# Altium schematic sheet ver060_ADC.SchDoc
size A3; SheetNumber: 4; SheetTotal: 6
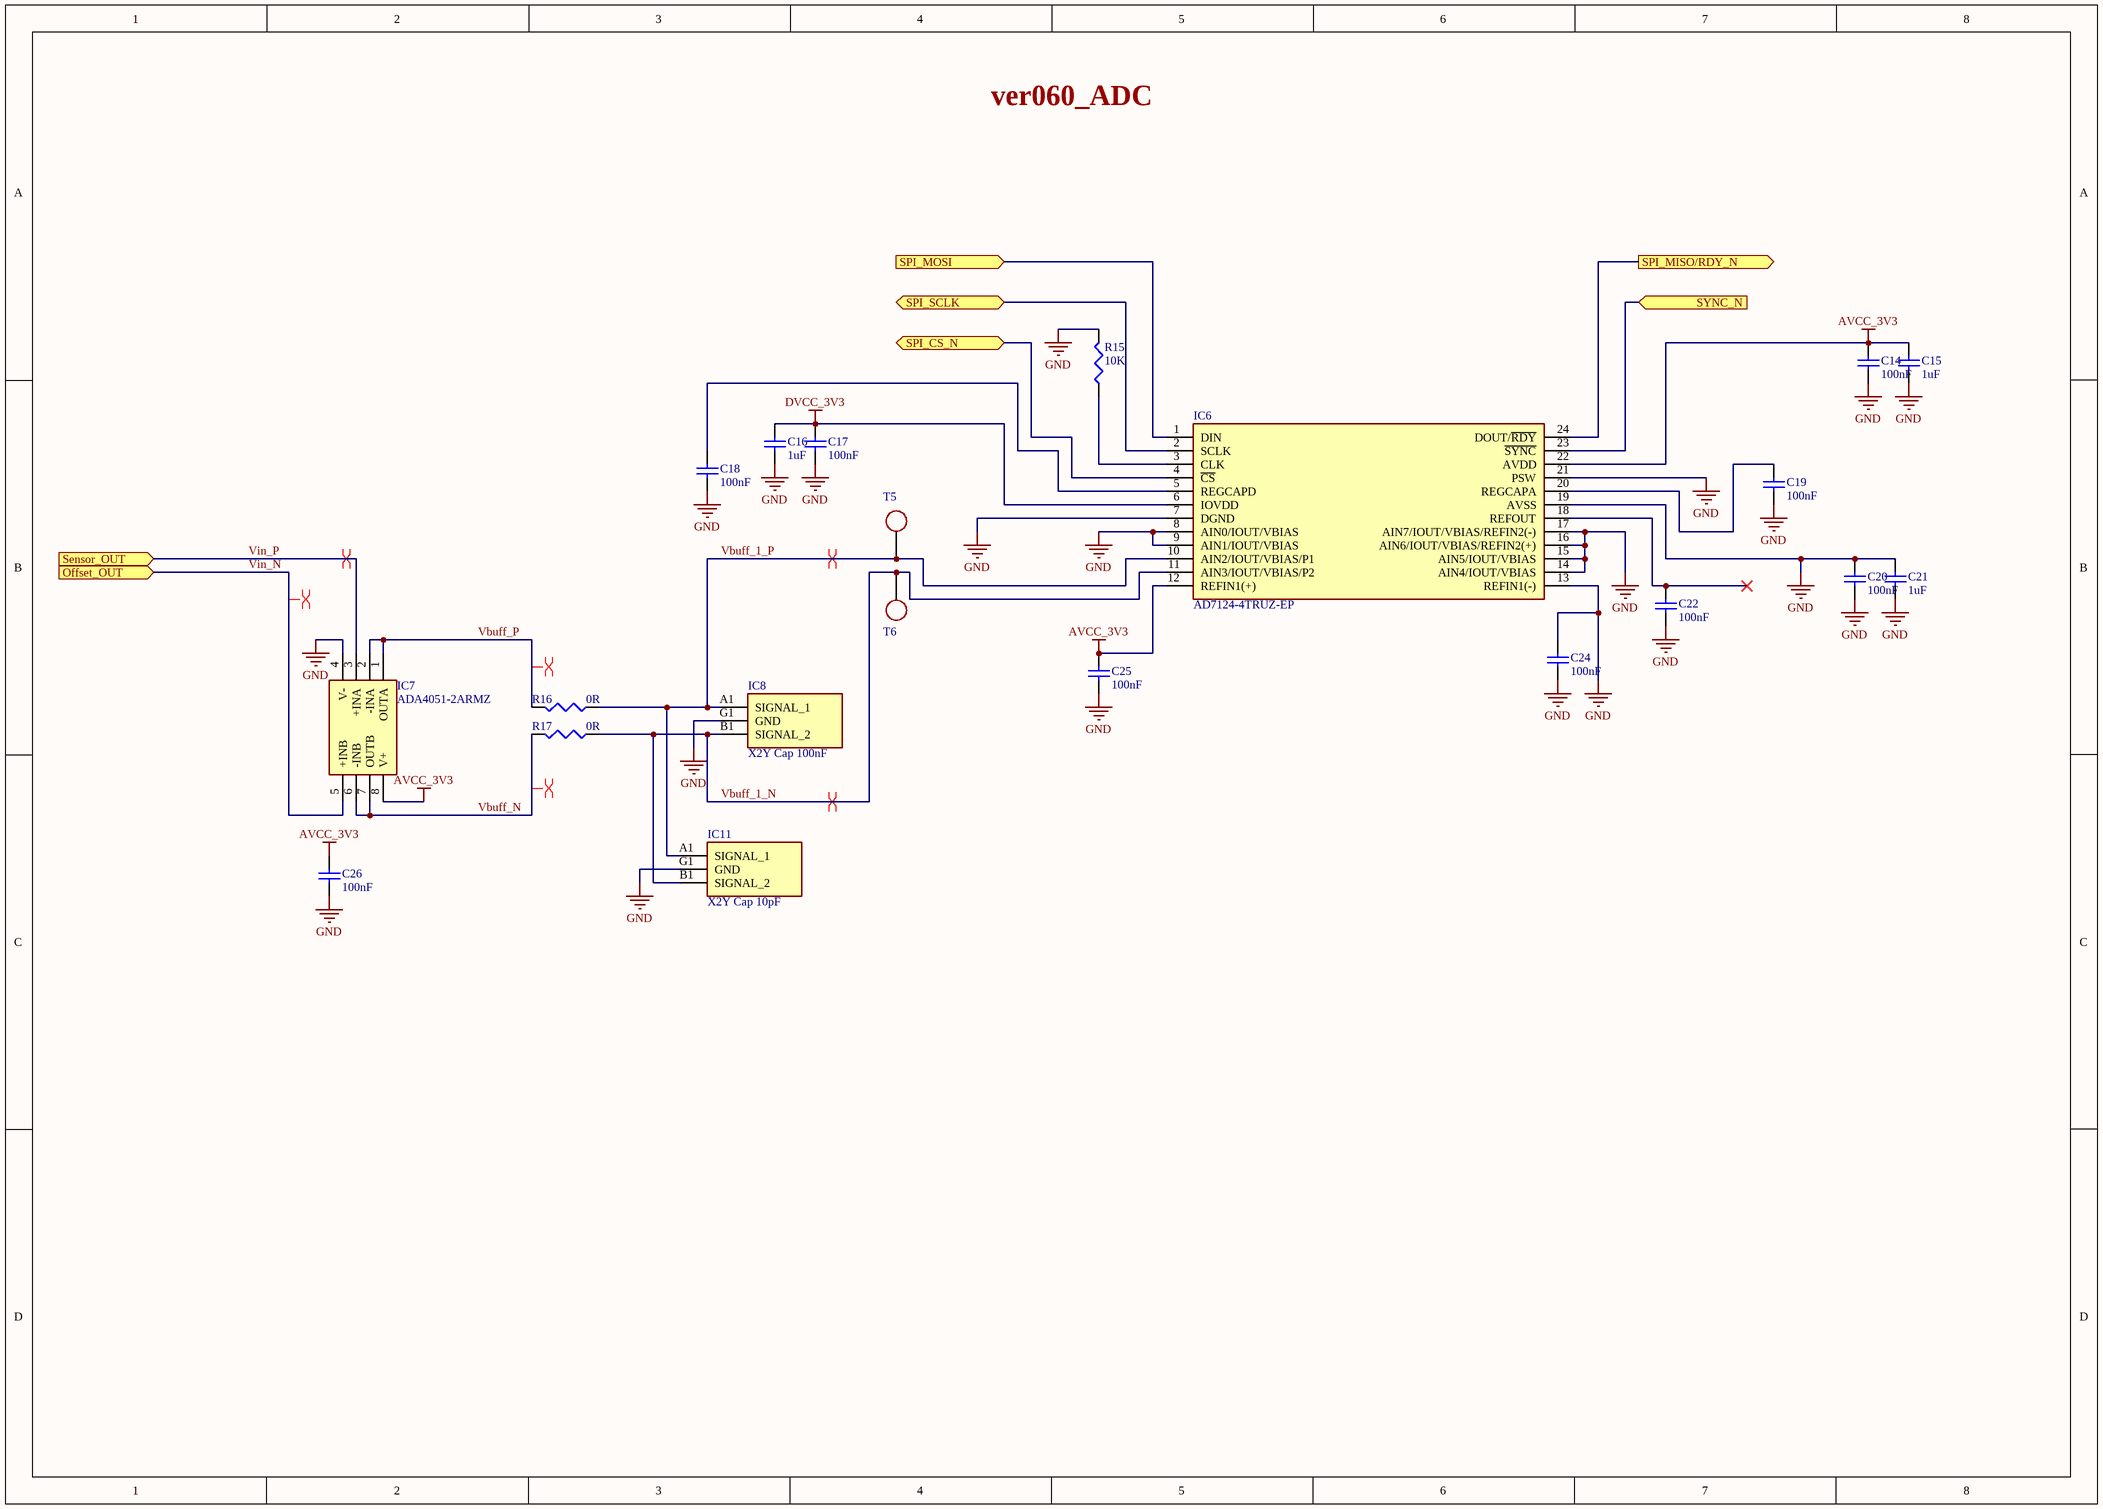
[diagram p0: ver060_ADC.SchDoc]

## Parts
C14  value 100nF  [1608[0603]]  (hidden comment: Cap Semi)
C15  value 1uF  [1608[0603]]  (hidden comment: Cap Semi)
C16  value 1uF  [1608[0603]]  (hidden comment: Cap Semi)
C17  value 100nF  [1608[0603]]  (hidden comment: Cap Semi)
C18  value 100nF  [1608[0603]]  (hidden comment: Cap Semi)
C19  value 100nF  [1608[0603]]  (hidden comment: Cap Semi)
C20  value 100nF  [1608[0603]]  (hidden comment: Cap Semi)
C21  value 1uF  [1608[0603]]  (hidden comment: Cap Semi)
C22  value 100nF  [1608[0603]]  (hidden comment: Cap Semi)
C24  value 100nF  [1608[0603]]  (hidden comment: Cap Semi)
C25  value 100nF  [1608[0603]]  (hidden comment: Cap Semi)
C26  value 100nF  [1608[0603]]  (hidden comment: Cap Semi)
IC6  AD7124-4TRUZ-EP  [SOP65P640X120-24N]
IC7  ADA4051-2ARMZ  [SOP65P490X110-8N]
IC8  X2Y Cap 100nF  [500X14W102MV4T]
IC11  X2Y Cap 10pF  [500X14W102MV4T]
R15  value 10K  [J1-0603]  (hidden comment: Res3)
R16  value 0R  [J1-0603]  (hidden comment: Res3)
R17  value 0R  [J1-0603]  (hidden comment: Res3)
T5  TP_SMT  [TP_SMT_Round_0.6x0.6]  (value not drawn)
T6  TP_SMT  [TP_SMT_Round_0.6x0.6]  (value not drawn)

## Ports
Offset_OUT (in), Sensor_OUT (in), SPI_CS_N (bidir), SPI_MISO/RDY_N (out), SPI_MOSI (in), SPI_SCLK (bidir), SYNC_N (in)

## Nets
AVCC_3V3: C14.1 C15.1 C25.1 C26.1 IC6.12(REFIN1(+)) IC6.22(AVDD) IC7.8(V+)
DVCC_3V3: C16.1 C17.1 IC6.6(IOVDD)
GND: C14.2 C15.2 C16.2 C17.2 C18.2 C19.2 C20.1 C20.2 C21.1 C21.2 C22.2 C24.1 C24.2 C25.2 C26.2 IC6.7(DGND) IC6.8(AIN0/IOUT/VBIAS) IC6.9(AIN1/IOUT/VBIAS) IC6.13(REFIN1(-)) IC6.14(AIN4/IOUT/VBIAS) IC6.15(AIN5/IOUT/VBIAS) IC6.16(AIN6/IOUT/VBIAS/REFIN2(+)) IC6.17(AIN7/IOUT/VBIAS/REFIN2(-)) IC6.19(AVSS) IC6.21(PSW) IC7.4(V-) IC8.G1(GND) IC11.G1(GND) R15.2
SPI_CS_N: IC6.4(~{CS}) ; port SPI_CS_N
SPI_MISO/RDY_N: IC6.24(DOUT/~{RDY}) ; port SPI_MISO/RDY_N
SPI_MOSI: IC6.1(DIN) ; port SPI_MOSI
SPI_SCLK: IC6.2(SCLK) ; port SPI_SCLK
SYNC_N: IC6.23(~{SYNC}) ; port SYNC_N
Vbuff_1_N: IC6.11(AIN3/IOUT/VBIAS/P2) IC8.B1(SIGNAL_2) IC11.B1(SIGNAL_2) R17.1 T6.1
Vbuff_1_P: IC6.10(AIN2/IOUT/VBIAS/P1) IC8.A1(SIGNAL_1) IC11.A1(SIGNAL_1) R16.1 T5.1
Vbuff_N: IC7.6(-INB) IC7.7(OUTB) R17.2
Vbuff_P: IC7.1(OUTA) IC7.2(-INA) R16.2
Vin_N: IC7.5(+INB) ; port Offset_OUT
Vin_P: IC7.3(+INA) ; port Sensor_OUT
NetC18_1: C18.1 IC6.5(REGCAPD)
NetC19_1: C19.1 IC6.20(REGCAPA)
NetC22_1: C22.1 IC6.18(REFOUT)
NetIC6_3: IC6.3(CLK) R15.1

## Layout directives
differential pair: Vbuff_1_N, Vbuff_1_P, Vbuff_N, Vbuff_P, Vin_N, Vin_P

## Notes on the sheet
- ver060_ADC

## Library data of the parts
C14-C22 C24-C26 = Cap Semi: Capacitor (Semiconductor SIM Model); Published: 8-Jun-2000; LatestRevisionDate: 29-May-2009; LatestRevisionNote: IPC-7351 Footprint Added.; PackageReference: C1206; Publisher: Altium Limited; PackageDescription: Chip Capacitor
IC6 = AD7124-4TRUZ-EP: Integrated Circuit; Manufacturer_Name: Analog Devices; Datasheet Link: https://www.arrow.com/en/products/ad7124-4truz-ep/analog-devices?region=nac; Height: 1.2mm; Manufacturer_Part_Number: AD7124-4TRUZ-EP; Mouser Part Number: 584-AD7124-4TRUZ-EP; Mouser Price/Stock: https://www.mouser.co.uk/ProductDetail/Analog-Devices/AD7124-4TRUZ-EP?qs=PzGy0jfpSMv6df%252BLlDr47w%3D%3D; Arrow Part Number: AD7124-4TRUZ-EP; Arrow Price/Stock: https://www.arrow.com/en/products/ad7124-4truz-ep/analog-devices?region=nac
IC7 = ADA4051-2ARMZ: Integrated Circuit; Manufacturer_Name: Analog Devices; Datasheet Link: https://www.analog.com/media/en/technical-documentation/data-sheets/ADA4051-1_4051-2.pdf; Height: 1.1mm; Manufacturer_Part_Number: ADA4051-2ARMZ; Mouser Part Number: 584-ADA4051-2ARMZ; Mouser Price/Stock: https://www.mouser.co.uk/ProductDetail/Analog-Devices/ADA4051-2ARMZ?qs=BpaRKvA4VqGG1fnokDYZmQ%3D%3D; Arrow Part Number: ADA4051-2ARMZ; Arrow Price/Stock: https://www.arrow.com/en/products/ada4051-2armz/analog-devices?region=europe
IC8 IC11 = 500X14W102MV4T: Integrated Circuit; Manufacturer_Name: JOHANSON TECHNOLOGY; Datasheet Link: https://www.johansondielectrics.com/downloads/x2y-filter-and-decoupling-capacitors.pdf; Height: 0.66mm; Manufacturer_Part_Number: 500X14W102MV4T; Mouser Part Number: 605-500X14W102MV4T; Mouser Price/Stock: https://www.mouser.co.uk/ProductDetail/Johanson-Dielectrics/500X14W102MV4T?qs=yCnrNFeXz%252Bg%252BGvc939b0KQ%3D%3D
R15-R17 = Res3: Resistor; Published: 8-Jun-2000; LatestRevisionDate: 29-May-2009; LatestRevisionNote: IPC-7351 Footprint Added.; PackageReference: J1-0603; Publisher: Altium Limited; PackageDescription: Chip Resistor